# Altium project Core429IBaseBoardVerE.PrjPCB
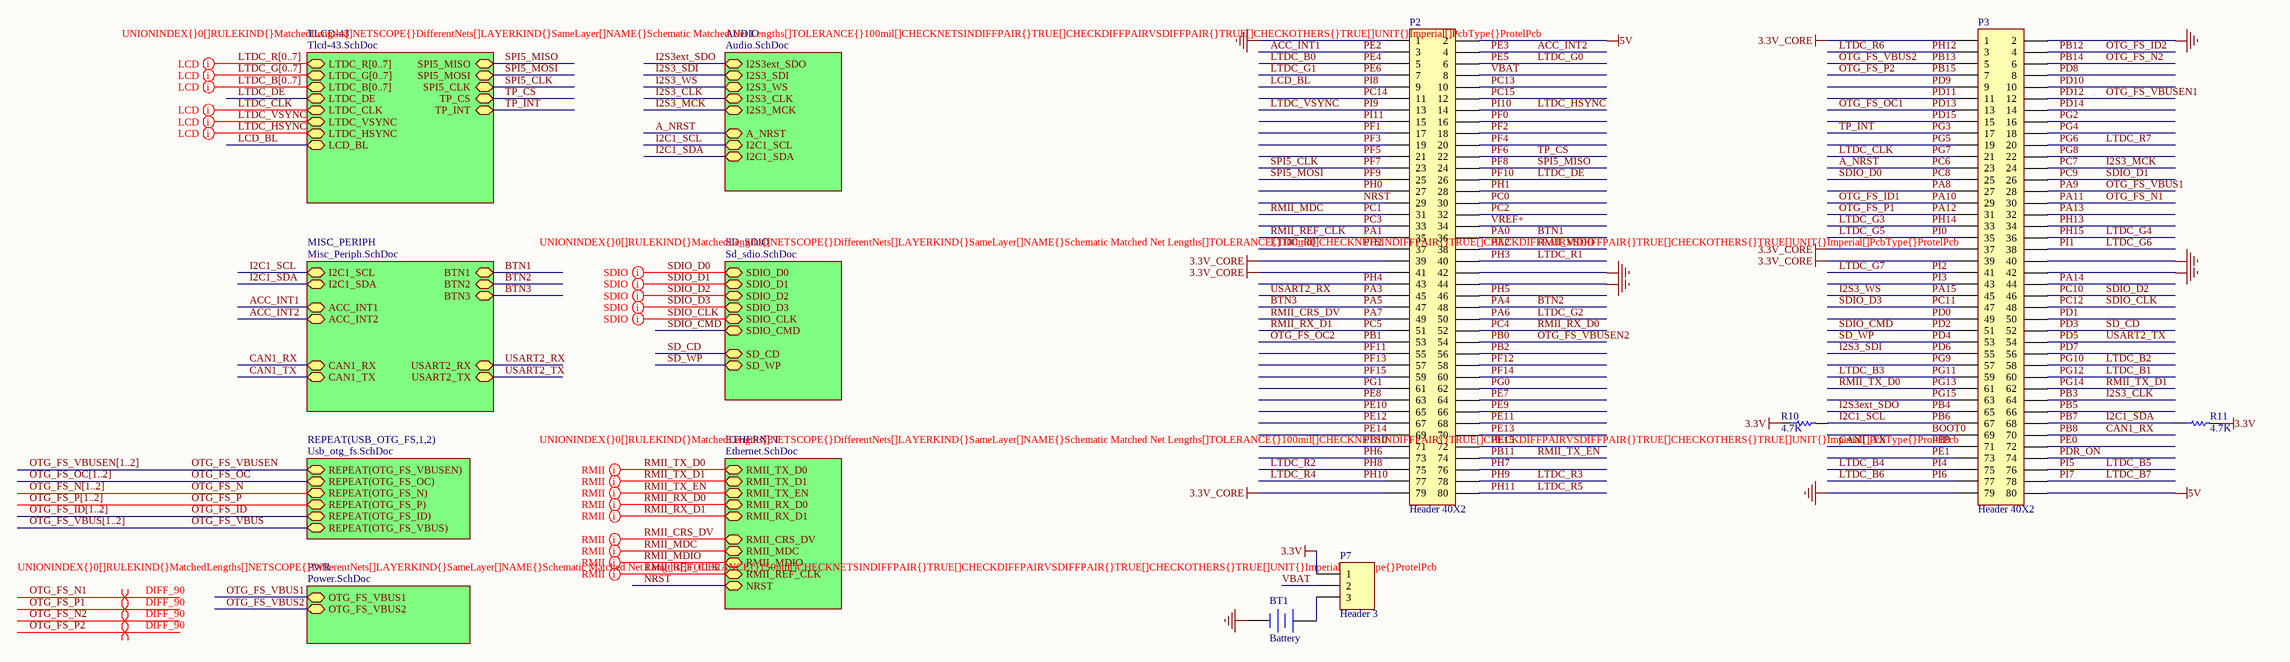
[diagram p0: Core429IBaseBoardVerE.SchDoc]
8 sheets, 137 parts. Net scope: hierarchical (ports join the sheet entries above them; power ports are global).
Board file: Core429IBaseBoardVerE.PcbDoc
Sheets:
  Core429IBaseBoardVerE.SchDoc
    PWR = Power.SchDoc
    AUDIO = Audio.SchDoc
    ETHERNET = Ethernet.SchDoc
    SD_SDIO = Sd_sdio.SchDoc
    TLCD-43 = Tlcd-43.SchDoc
    MISC_PERIPH = Misc_Periph.SchDoc
    USB_OTG_FS1 = Usb_otg_fs.SchDoc
    USB_OTG_FS2 = Usb_otg_fs.SchDoc

## Sheet Core429IBaseBoardVerE.SchDoc
size A2

### Parts
BT1  Battery  [PN3000]
P2  Header 40X2  [SHDR2X40]
P3  Header 40X2  [SHDR2X40]
P7  Header 3  [HDR1X3]
R10  value 4.7K  [RESC2012N]  (hidden comment: Res)
R11  value 4.7K  [RESC2012N]  (hidden comment: Res)

### Sub-sheets
AUDIO = Audio.SchDoc: I2S3_SDI, I2S3_WS, I2S3_CLK, I2S3_MCK, A_NRST, I2C1_SCL, I2C1_SDA, I2S3ext_SDO
ETHERNET = Ethernet.SchDoc: RMII_TX_D0, RMII_TX_D1, RMII_TX_EN, RMII_RX_D0, RMII_RX_D1, RMII_CRS_DV, RMII_MDC, RMII_MDIO, RMII_REF_CLK, NRST
MISC_PERIPH = Misc_Periph.SchDoc: I2C1_SCL, I2C1_SDA, ACC_INT1, ACC_INT2, BTN3, BTN2, BTN1, CAN1_RX, CAN1_TX, USART2_TX, USART2_RX
PWR = Power.SchDoc: OTG_FS_VBUS1, OTG_FS_VBUS2
REPEAT(USB_OTG_FS,1,2) = Usb_otg_fs.SchDoc: REPEAT(OTG_FS_VBUSEN), REPEAT(OTG_FS_OC), REPEAT(OTG_FS_N), REPEAT(OTG_FS_P), REPEAT(OTG_FS_ID), REPEAT(OTG_FS_VBUS)
SD_SDIO = Sd_sdio.SchDoc: SDIO_D0, SDIO_D1, SDIO_D2, SDIO_D3, SDIO_CLK, SDIO_CMD, SD_CD, SD_WP
TLCD-43 = Tlcd-43.SchDoc: LTDC_R[0..7], LTDC_G[0..7], LTDC_B[0..7], LTDC_DE, LTDC_CLK, LTDC_VSYNC, LTDC_HSYNC, LCD_BL, TP_INT, TP_CS, SPI5_CLK, SPI5_MOSI, SPI5_MISO

### Nets
3.3V: P7.1 R10.1 R11.2
3.3V_CORE: P2.39 P2.41 P2.79 P3.1 P3.37 P3.39
5V: P2.2 P3.80
DGND: BT1.2(-) P2.1 P2.42 P2.44 P3.2 P3.40 P3.42 P3.79
A_NRST: P3.23 ; sheet AUDIO/A_NRST  [also labelled PC6]
ACC_INT1: P2.3 ; sheet MISC_PERIPH/ACC_INT1  [also labelled PE2]
ACC_INT2: P2.4 ; sheet MISC_PERIPH/ACC_INT2  [also labelled PE3]
BOOT0: P3.69
BTN1: P2.36 ; sheet MISC_PERIPH/BTN1  [also labelled PA0]
BTN2: P2.48 ; sheet MISC_PERIPH/BTN2  [also labelled PA4]
BTN3: P2.47 ; sheet MISC_PERIPH/BTN3  [also labelled PA5]
CAN1_RX: P3.70 ; sheet MISC_PERIPH/CAN1_RX  [also labelled PB8]
CAN1_TX: P3.71 ; sheet MISC_PERIPH/CAN1_TX  [also labelled PB9]
I2C1_SCL: P3.67 R10.2 ; sheet AUDIO/I2C1_SCL, sheet MISC_PERIPH/I2C1_SCL  [also labelled PB6]
I2C1_SDA: P3.68 R11.1 ; sheet AUDIO/I2C1_SDA, sheet MISC_PERIPH/I2C1_SDA  [also labelled PB7]
I2S3_CLK: P3.64 ; sheet AUDIO/I2S3_CLK  [also labelled PB3]
I2S3_MCK: P3.24 ; sheet AUDIO/I2S3_MCK  [also labelled PC7]
I2S3_SDI: P3.55 ; sheet AUDIO/I2S3_SDI  [also labelled PD6]
I2S3_WS: P3.45 ; sheet AUDIO/I2S3_WS  [also labelled PA15]
I2S3ext_SDO: P3.65 ; sheet AUDIO/I2S3ext_SDO  [also labelled PB4]
LCD_BL: P2.9 ; sheet TLCD-43/LCD_BL  [also labelled PI8]
LTDC_B0: P2.5  [also labelled PE4]
LTDC_B1: P3.60  [also labelled PG12]
LTDC_B2: P3.58  [also labelled PG10]
LTDC_B3: P3.59  [also labelled PG11]
LTDC_B4: P3.75  [also labelled PI4]
LTDC_B5: P3.76  [also labelled PI5]
LTDC_B6: P3.77  [also labelled PI6]
LTDC_B7: P3.78  [also labelled PI7]
LTDC_CLK: P3.21 ; sheet TLCD-43/LTDC_CLK  [also labelled PG7]
LTDC_DE: P2.26 ; sheet TLCD-43/LTDC_DE  [also labelled PF10]
LTDC_G0: P2.6  [also labelled PE5]
LTDC_G1: P2.7  [also labelled PE6]
LTDC_G2: P2.50  [also labelled PA6]
LTDC_G3: P3.33  [also labelled PH14]
LTDC_G4: P3.36  [also labelled PH15]
LTDC_G5: P3.35  [also labelled PI0]
LTDC_G6: P3.38  [also labelled PI1]
LTDC_G7: P3.41  [also labelled PI2]
LTDC_HSYNC: P2.14 ; sheet TLCD-43/LTDC_HSYNC  [also labelled PI10]
LTDC_R0: P2.37  [also labelled PH2]
LTDC_R1: P2.40  [also labelled PH3]
LTDC_R2: P2.75  [also labelled PH8]
LTDC_R3: P2.78  [also labelled PH9]
LTDC_R4: P2.77  [also labelled PH10]
LTDC_R5: P2.80  [also labelled PH11]
LTDC_R6: P3.3  [also labelled PH12]
LTDC_R7: P3.20  [also labelled PG6]
LTDC_VSYNC: P2.13 ; sheet TLCD-43/LTDC_VSYNC  [also labelled PI9]
NRST: P2.29 ; sheet ETHERNET/NRST
OTG_FS_ID: sheet REPEAT(USB_OTG_FS,1,2)/REPEAT(OTG_FS_ID)
OTG_FS_ID1: P3.29  [also labelled PA10]
OTG_FS_ID2: P3.4  [also labelled PB12]
OTG_FS_N: sheet REPEAT(USB_OTG_FS,1,2)/REPEAT(OTG_FS_N)
OTG_FS_N1: P3.30  [also labelled PA11]
OTG_FS_N2: P3.6  [also labelled PB14]
OTG_FS_OC: sheet REPEAT(USB_OTG_FS,1,2)/REPEAT(OTG_FS_OC)
OTG_FS_OC1: P3.13  [also labelled PD13]
OTG_FS_OC2: P2.53  [also labelled PB1]
OTG_FS_P: sheet REPEAT(USB_OTG_FS,1,2)/REPEAT(OTG_FS_P)
OTG_FS_P1: P3.31  [also labelled PA12]
OTG_FS_P2: P3.7  [also labelled PB15]
OTG_FS_VBUS: sheet REPEAT(USB_OTG_FS,1,2)/REPEAT(OTG_FS_VBUS)
OTG_FS_VBUS1: P3.28 ; sheet PWR/OTG_FS_VBUS1  [also labelled PA9]
OTG_FS_VBUS2: P3.5 ; sheet PWR/OTG_FS_VBUS2  [also labelled PB13]
OTG_FS_VBUSEN: sheet REPEAT(USB_OTG_FS,1,2)/REPEAT(OTG_FS_VBUSEN)
OTG_FS_VBUSEN1: P3.12  [also labelled PD12]
OTG_FS_VBUSEN2: P2.54  [also labelled PB0]
PA1: P2.35 ; sheet ETHERNET/RMII_REF_CLK  [also labelled RMII_REF_CLK]
PA2: P2.38 ; sheet ETHERNET/RMII_MDIO  [also labelled RMII_MDIO]
PA3: P2.45 ; sheet MISC_PERIPH/USART2_RX  [also labelled USART2_RX]
PA7: P2.49 ; sheet ETHERNET/RMII_CRS_DV  [also labelled RMII_CRS_DV]
PA8: P3.27
PA13: P3.32
PA14: P3.44
PB2: P2.56
PB5: P3.66
PB10: P2.71
PB11: P2.74 ; sheet ETHERNET/RMII_TX_EN  [also labelled RMII_TX_EN]
PC0: P2.30
PC1: P2.31 ; sheet ETHERNET/RMII_MDC  [also labelled RMII_MDC]
PC2: P2.32
PC3: P2.33
PC4: P2.52 ; sheet ETHERNET/RMII_RX_D0  [also labelled RMII_RX_D0]
PC5: P2.51 ; sheet ETHERNET/RMII_RX_D1  [also labelled RMII_RX_D1]
PC8: P3.25 ; sheet SD_SDIO/SDIO_D0  [also labelled SDIO_D0]
PC9: P3.26 ; sheet SD_SDIO/SDIO_D1  [also labelled SDIO_D1]
PC10: P3.46 ; sheet SD_SDIO/SDIO_D2  [also labelled SDIO_D2]
PC11: P3.47 ; sheet SD_SDIO/SDIO_D3  [also labelled SDIO_D3]
PC12: P3.48 ; sheet SD_SDIO/SDIO_CLK  [also labelled SDIO_CLK]
PC13: P2.10
PC14: P2.11
PC15: P2.12
PD0: P3.49
PD1: P3.50
PD2: P3.51 ; sheet SD_SDIO/SDIO_CMD  [also labelled SDIO_CMD]
PD3: P3.52 ; sheet SD_SDIO/SD_CD  [also labelled SD_CD]
PD4: P3.53 ; sheet SD_SDIO/SD_WP  [also labelled SD_WP]
PD5: P3.54 ; sheet MISC_PERIPH/USART2_TX  [also labelled USART2_TX]
PD7: P3.56
PD8: P3.8
PD9: P3.9
PD10: P3.10
PD11: P3.11
PD14: P3.14
PD15: P3.15
PDR_ON: P3.74
PE0: P3.72
PE1: P3.73
PE7: P2.64
PE8: P2.63
PE9: P2.66
PE10: P2.65
PE11: P2.68
PE12: P2.67
PE13: P2.70
PE14: P2.69
PE15: P2.72
PF0: P2.16
PF1: P2.17
PF2: P2.18
PF3: P2.19
PF4: P2.20
PF5: P2.21
PF6: P2.22 ; sheet TLCD-43/TP_CS  [also labelled TP_CS]
PF7: P2.23 ; sheet TLCD-43/SPI5_CLK  [also labelled SPI5_CLK]
PF8: P2.24 ; sheet TLCD-43/SPI5_MISO  [also labelled SPI5_MISO]
PF9: P2.25 ; sheet TLCD-43/SPI5_MOSI  [also labelled SPI5_MOSI]
PF11: P2.55
PF12: P2.58
PF13: P2.57
PF14: P2.60
PF15: P2.59
PG0: P2.62
PG1: P2.61
PG2: P3.16
PG3: P3.17 ; sheet TLCD-43/TP_INT  [also labelled TP_INT]
PG4: P3.18
PG5: P3.19
PG8: P3.22
PG9: P3.57
PG13: P3.61 ; sheet ETHERNET/RMII_TX_D0  [also labelled RMII_TX_D0]
PG14: P3.62 ; sheet ETHERNET/RMII_TX_D1  [also labelled RMII_TX_D1]
PG15: P3.63
PH0: P2.27
PH1: P2.28
PH4: P2.43
PH5: P2.46
PH6: P2.73
PH7: P2.76
PH13: P3.34
PI3: P3.43
PI11: P2.15
VBAT: P2.8 P7.2
VREF+: P2.34
NetBT1_1: BT1.1(+) P7.3

### Buses and harness runs
bus LTDC_B[0..7] = sheet TLCD-43/LTDC_B[0..7]
bus LTDC_G[0..7] = sheet TLCD-43/LTDC_G[0..7]
bus LTDC_R[0..7] = sheet TLCD-43/LTDC_R[0..7]
bus OTG_FS_ID[1..2]
bus OTG_FS_N[1..2]
bus OTG_FS_OC[1..2]
bus OTG_FS_P[1..2]
bus OTG_FS_VBUS[1..2]
bus OTG_FS_VBUSEN[1..2]

### Layout directives
net class RMII; rule Matched Net Lengths [Tolerance = 100mil]: PA1, PA2, PA7, PB11, PC1, PC4, PC5, PG13, PG14
net class LCD; rule Matched Net Lengths [Tolerance = 100mil]: (no net found under the mark), LTDC_CLK, LTDC_HSYNC, LTDC_VSYNC
differential pair; net class DIFF_90; rule Matched Net Lengths [Tolerance = 150mil]: OTG_FS_N1, OTG_FS_N2, OTG_FS_P1, OTG_FS_P2
net class SDIO; rule Matched Net Lengths [Tolerance = 100mil]: PC8, PC9, PC10, PC11, PC12

### Library data of the parts
BT1 = Battery: Multicell Battery
P2 P3 = Header 40X2: Header, 40-Pin, Dual row
P7 = Header 3: Header, 3-Pin
R10 R11 = Res: Resistor

## Sheet Power.SchDoc
size A4
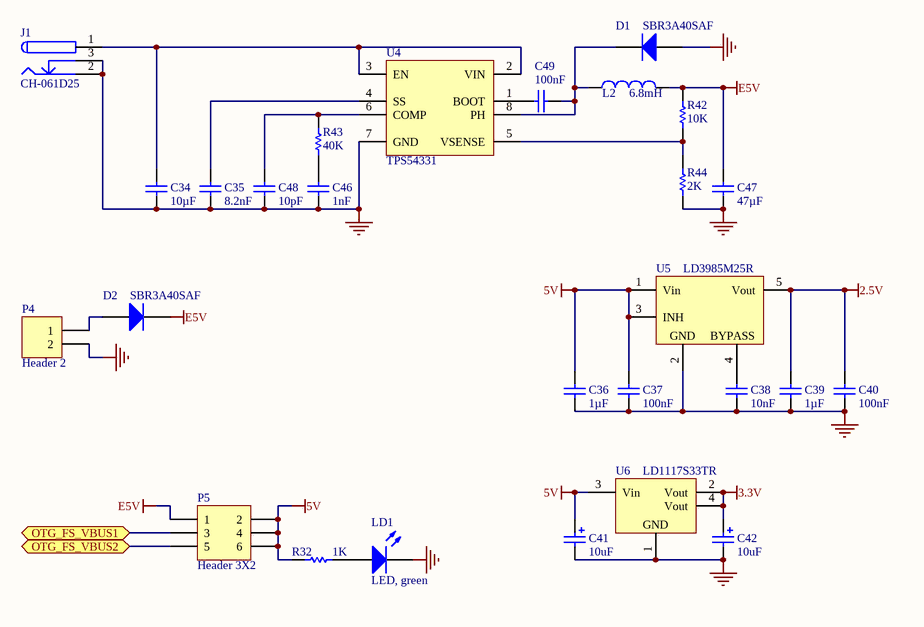
[diagram p1: Power.SchDoc]

### Parts
C34  value 10µF  [CAPC3216N]  (hidden comment: Cap)
C35  value 8.2nF  [CAPC2012N]  (hidden comment: Cap)
C36  value 1µF  [CAPC3216N]  (hidden comment: Cap)
C37  value 100nF  [CAPC2012N]  (hidden comment: Cap)
C38  value 10nF  [CAPC2012N]  (hidden comment: Cap)
C39  value 1µF  [CAPC3216N]  (hidden comment: Cap)
C40  value 100nF  [CAPC2012N]  (hidden comment: Cap)
C41  value 10uF  [TC3216-1206]  (hidden comment: Cap Pol)
C42  value 10uF  [TC3216-1206]  (hidden comment: Cap Pol)
C46  value 1nF  [CAPC2012N]  (hidden comment: Cap)
C47  value 47µF  [CAPC3216N]  (hidden comment: Cap)
C48  value 10pF  [CAPC2012N]  (hidden comment: Cap)
C49  value 100nF  [CAPC2012N]  (hidden comment: Cap)
D1  SBR3A40SAF  [CD-DO214AC]
D2  SBR3A40SAF  [CD-DO214AC]
J1  CH-061D25  [CH-061D25]
L2  value 6.8mH  [INDP6560X45M]  (hidden comment: Inductor)
LD1  LED, green  [CLED2012-0805]
P4  Header 2  [HDR1X2H]
P5  Header 3X2  [HDR2X3]
R32  value 1K  [RESC2012N]  (hidden comment: 1206)
R42  value 10K  [RESC2012N]  (hidden comment: Res)
R43  value 40K  [RESC2012N]  (hidden comment: Res)
R44  value 2K  [RESC2012N]  (hidden comment: Res)
U4  TPS54331  [SOIC127P600X173-8M]
U5  LD3985M25R  [SOT95P280X145-5M]
U6  LD1117S33TR  [SOT230P700X181-4M]

### Ports
OTG_FS_VBUS1 (bidir), OTG_FS_VBUS2 (bidir)

### Nets
2.5V: C39.2 C40.2 U5.5(Vout)
3.3V: C42.1 U6.2(Vout) U6.4(Vout)
5V: C36.2 C37.2 C41.1 P5.2 P5.4 P5.6 R32.2 U5.1(Vin) U5.3(INH) U6.3(Vin)
DGND: C34.1 C35.1 C36.1 C37.1 C38.1 C39.1 C40.1 C41.2 C42.2 C46.1 C47.1 C48.1 D1.1(A) J1.2 J1.3 LD1.2(K) P4.2 R44.1 U4.7(GND) U5.2(GND) U6.1(GND)
E5V: C47.2 D2.2(K) L2.2 P5.1 R42.2
OTG_FS_VBUS1: P5.3 ; port OTG_FS_VBUS1
OTG_FS_VBUS2: P5.5 ; port OTG_FS_VBUS2
NetC34_2: C34.2 J1.1 U4.2(VIN) U4.3(EN)
NetC35_2: C35.2 U4.4(SS)
NetC38_2: C38.2 U5.4(BYPASS)
NetC46_2: C46.2 R43.1
NetC48_2: C48.2 R43.2 U4.6(COMP)
NetC49_1: C49.1 D1.2(K) L2.1 U4.8(PH)
NetC49_2: C49.2 U4.1(BOOT)
NetD2_1: D2.1(A) P4.1
NetLD1_1: LD1.1(A) R32.1
NetR42_1: R42.1 R44.2 U4.5(VSENSE)

### Library data of the parts
C34-C40 C46-C49 = Cap: Capacitor
C41 C42 = Cap Pol: Polarized Capacitor
D1 D2 = Diode: Default Diode
J1 = PWR2.5: Low Voltage Power Supply Connector
LD1 = LED: Light emitting diode
P4 = Header 2: Header, 2-Pin
P5 = Header 3X2: Header, 3-Pin, Dual row
R32 R42-R44 = Res: Resistor
U4 = TPS54331: 3-A, 28-V Input, Step Down DC-DC Converter With Eco-mode
U5 = LD3985M: Ultra low drop-low noise BiCMOS voltage  regulators low ESR capacitors compatible
U6 = LD1117S: Adjustable and fixed low drop positive voltage regulator

## Sheet Audio.SchDoc
size A4
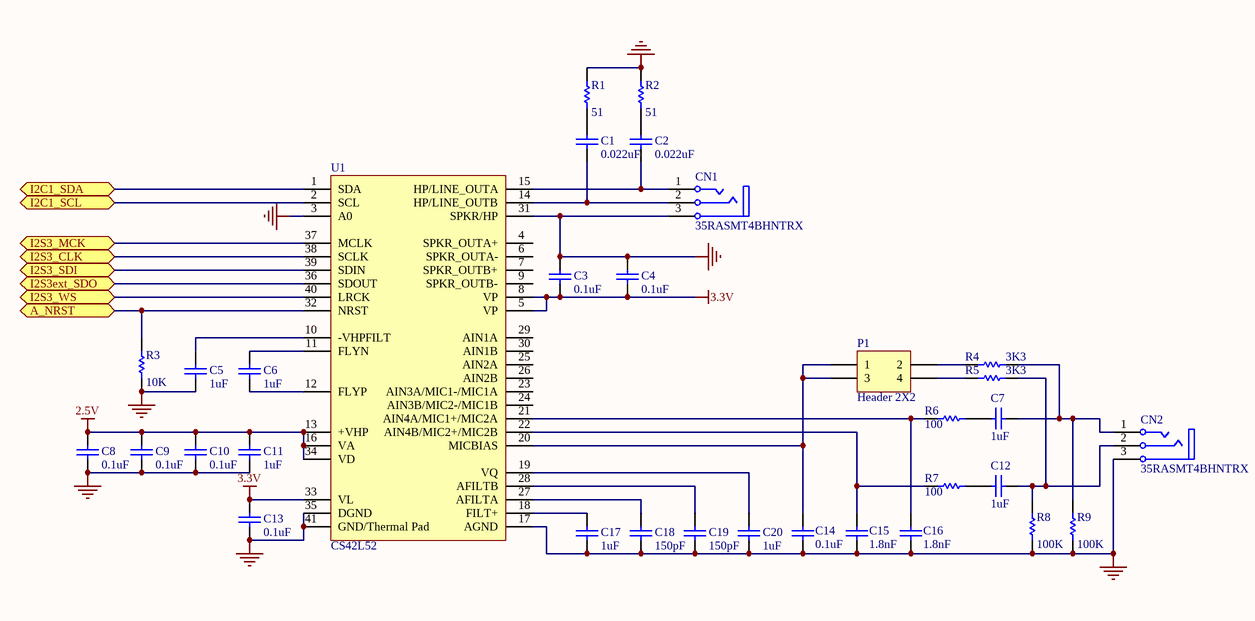
[diagram p2: Audio.SchDoc]

### Parts
C1  value 0.022uF  [CAPC2012N]  (hidden comment: Cap)
C2  value 0.022uF  [CAPC2012N]  (hidden comment: Cap)
C3  value 0.1uF  [CAPC2012N]  (hidden comment: Cap)
C4  value 0.1uF  [CAPC2012N]  (hidden comment: Cap)
C5  value 1uF  [CAPC3216N]  (hidden comment: Cap)
C6  value 1uF  [CAPC3216N]  (hidden comment: Cap)
C7  value 1uF  [CAPC3216N]  (hidden comment: Cap)
C8  value 0.1uF  [CAPC2012N]  (hidden comment: Cap)
C9  value 0.1uF  [CAPC2012N]  (hidden comment: Cap)
C10  value 0.1uF  [CAPC2012N]  (hidden comment: Cap)
C11  value 1uF  [CAPC3216N]  (hidden comment: Cap)
C12  value 1uF  [CAPC3216N]  (hidden comment: Cap)
C13  value 0.1uF  [CAPC2012N]  (hidden comment: Cap)
C14  value 0.1uF  [CAPC2012N]  (hidden comment: Cap)
C15  value 1.8nF  [CAPC2012N]  (hidden comment: Cap)
C16  value 1.8nF  [CAPC2012N]  (hidden comment: Cap)
C17  value 1uF  [CAPC3216N]  (hidden comment: Cap)
C18  value 150pF  [CAPC2012N]  (hidden comment: Cap)
C19  value 150pF  [CAPC2012N]  (hidden comment: Cap)
C20  value 1uF  [CAPC3216N]  (hidden comment: Cap)
CN1  35RASMT4BHNTRX  [35RASMT4BHNTRX]
CN2  35RASMT4BHNTRX  [35RASMT4BHNTRX]
P1  Header 2X2  [HDR2X2]
R1  value 51  [RESC2012N]  (hidden comment: 1206)
R2  value 51  [RESC2012N]  (hidden comment: 1206)
R3  value 10K  [RESC2012N]  (hidden comment: 1206)
R4  value 3K3  [RESC2012N]  (hidden comment: 1206)
R5  value 3K3  [RESC2012N]  (hidden comment: 1206)
R6  value 100  [RESC2012N]  (hidden comment: 1206)
R7  value 100  [RESC2012N]  (hidden comment: 1206)
R8  value 100K  [RESC2012N]  (hidden comment: 1206)
R9  value 100K  [RESC2012N]  (hidden comment: 1206)
U1  CS42L52  [QFN50P600X600X100-40M]

### Ports
A_NRST (bidir), I2C1_SCL (bidir), I2C1_SDA (bidir), I2S3_CLK (bidir), I2S3_MCK (bidir), I2S3_SDI (bidir), I2S3_WS (bidir), I2S3ext_SDO (bidir)

### Nets
2.5V: C8.2 C9.2 C10.2 C11.2 U1.13(+VHP) U1.16(VA) U1.34(VD)
3.3V: C3.1 C4.1 C13.2 U1.5(VP) U1.8(VP) U1.33(VL)
DGND: C3.2 C4.2 C5.1 C8.1 C9.1 C10.1 C11.1 C13.1 C14.2 C15.2 C16.2 C17.1 C18.1 C19.1 C20.1 CN1.3(S) CN2.3(S) R1.2 R2.2 R3.1 R8.1 R9.1 U1.3(A0) U1.17(AGND) U1.31(SPKR/HP) U1.35(DGND) U1.41(GND/Thermal_Pad)
A_NRST: R3.2 U1.32(NRST) ; port A_NRST
I2C1_SCL: U1.2(SCL) ; port I2C1_SCL
I2C1_SDA: U1.1(SDA) ; port I2C1_SDA
I2S3_CLK: U1.38(SCLK) ; port I2S3_CLK
I2S3_MCK: U1.37(MCLK) ; port I2S3_MCK
I2S3_SDI: U1.39(SDIN) ; port I2S3_SDI
I2S3_WS: U1.40(LRCK) ; port I2S3_WS
I2S3ext_SDO: U1.36(SDOUT) ; port I2S3ext_SDO
NetC1_1: C1.1 CN1.2(R) U1.14(HP/LINE_OUTB)
NetC1_2: C1.2 R1.1
NetC2_1: C2.1 CN1.1(T) U1.15(HP/LINE_OUTA)
NetC2_2: C2.2 R2.1
NetC5_2: C5.2 U1.10(-VHPFILT)
NetC6_1: C6.1 U1.12(FLYP)
NetC6_2: C6.2 U1.11(FLYN)
NetC7_1: C7.1 CN2.1(T) R4.1 R9.2
NetC7_2: C7.2 R6.1
NetC12_1: C12.1 CN2.2(R) R5.1 R8.2
NetC12_2: C12.2 R7.1
NetC14_1: C14.1 P1.1 P1.3 U1.20(MICBIAS)
NetC15_1: C15.1 R7.2 U1.22(AIN4B/MIC2+/MIC2B)
NetC16_1: C16.1 R6.2 U1.21(AIN4A/MIC1+/MIC2A)
NetC17_2: C17.2 U1.18(FILT+)
NetC18_2: C18.2 U1.27(AFILTA)
NetC19_2: C19.2 U1.28(AFILTB)
NetC20_2: C20.2 U1.19(VQ)
NetP1_2: P1.2 R4.2
NetP1_4: P1.4 R5.2

Not connected (* = marked no-connect by the designer): U1 4(SPKR_OUTA+) 6(SPKR_OUTA-) 7(SPKR_OUTB+) 9(SPKR_OUTB-) 23(AIN3A/MIC1-/MIC1A) 24(AIN3B/MIC2-/MIC1B) 25(AIN2A) 26(AIN2B) 29(AIN1A) 30(AIN1B)

### Library data of the parts
C1-C20 = Cap: Capacitor
CN1 CN2 = Phonejack3: 3.5mm Stereo Jack
P1 = Header 2X2: Header, 2-Pin, Dual row
R1-R9 = Res: Resistor
U1 = CS42L52: Low-power, Stereo CODEC w/ Headphone & Speaker Amps

## Sheet Ethernet.SchDoc
size A3
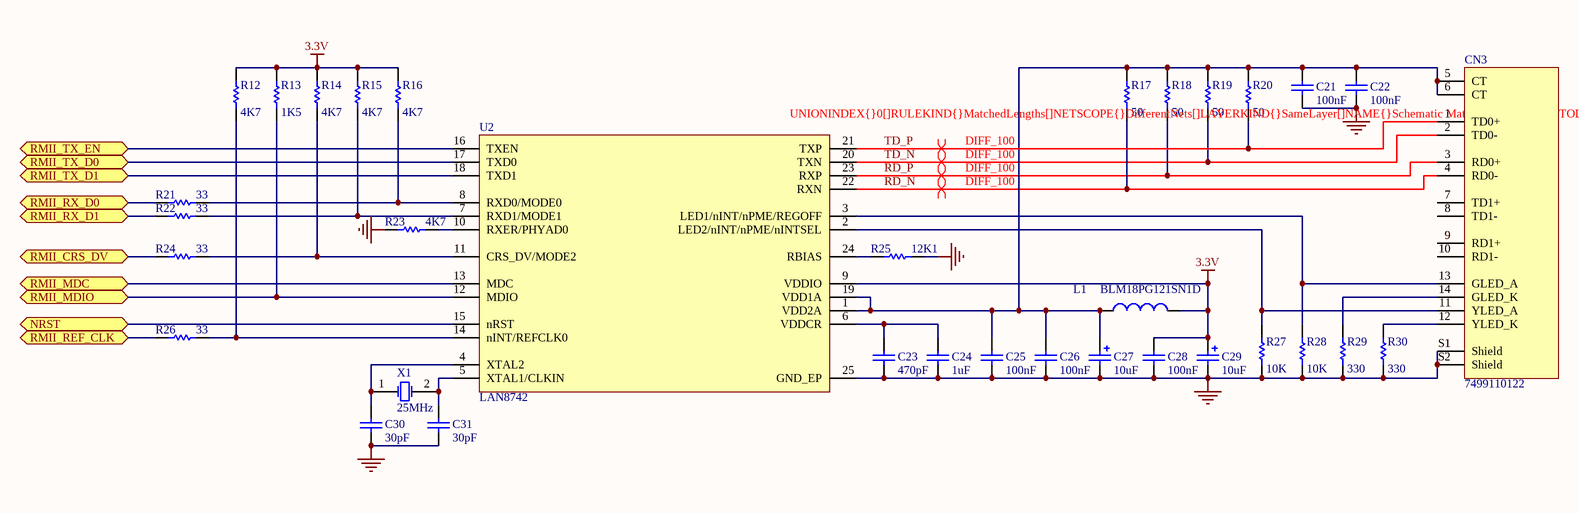
[diagram p3: Ethernet.SchDoc]

### Parts
C21  value 100nF  [CAPC2012N]  (hidden comment: Cap)
C22  value 100nF  [CAPC2012N]  (hidden comment: Cap)
C23  value 470pF  [CAPC2012N]  (hidden comment: Cap)
C24  value 1uF  [CAPC3216N]  (hidden comment: Cap)
C25  value 100nF  [CAPC2012N]  (hidden comment: Cap)
C26  value 100nF  [CAPC2012N]  (hidden comment: Cap)
C27  value 10uF  [TC3216-1206]  (hidden comment: Cap Pol)
C28  value 100nF  [CAPC2012N]  (hidden comment: Cap)
C29  value 10uF  [TC3216-1206]  (hidden comment: Cap Pol)
C30  value 30pF  [CAPC2012N]  (hidden comment: Cap)
C31  value 30pF  [CAPC2012N]  (hidden comment: Cap)
CN3  7499110122  [7499110122]
L1  value BLM18PG121SN1D  [INDC2012N]  (hidden comment: Inductor)
R12  value 4K7  [RESC2012N]  (hidden comment: 1206)
R13  value 1K5  [RESC2012N]  (hidden comment: 1206)
R14  value 4K7  [RESC2012N]  (hidden comment: 1206)
R15  value 4K7  [RESC2012N]  (hidden comment: 1206)
R16  value 4K7  [RESC2012N]  (hidden comment: 1206)
R17  value 50  [RESC2012N]  (hidden comment: 1206)
R18  value 50  [RESC2012N]  (hidden comment: 1206)
R19  value 50  [RESC2012N]  (hidden comment: 1206)
R20  value 50  [RESC2012N]  (hidden comment: 1206)
R21  value 33  [RESC2012N]  (hidden comment: 1206)
R22  value 33  [RESC2012N]  (hidden comment: 1206)
R23  value 4K7  [RESC2012N]  (hidden comment: 1206)
R24  value 33  [RESC2012N]  (hidden comment: 1206)
R25  value 12K1  [RESC2012N]  (hidden comment: 1206)
R26  value 33  [RESC2012N]  (hidden comment: 1206)
R27  value 10K  [RESC2012N]  (hidden comment: 1206)
R28  value 10K  [RESC2012N]  (hidden comment: 1206)
R29  value 330  [RESC2012N]  (hidden comment: 1206)
R30  value 330  [RESC2012N]  (hidden comment: 1206)
U2  LAN8742  [QFN50P400X400X100-24M]
X1  25MHz  [QC5CB]

### Ports
NRST (bidir), RMII_CRS_DV (bidir), RMII_MDC (bidir), RMII_MDIO (bidir), RMII_REF_CLK (bidir), RMII_RX_D0 (bidir), RMII_RX_D1 (bidir), RMII_TX_D0 (bidir), RMII_TX_D1 (bidir), RMII_TX_EN (bidir)

### Nets
3.3V: C28.2 C29.1 L1.2 R12.2 R13.2 R14.2 R15.2 R16.2 U2.9(VDDIO)
DGND: C21.1 C22.1 C23.1 C24.1 C25.1 C26.1 C27.2 C28.1 C29.2 C30.1 C31.1 CN3.S1(Shield) CN3.S2(Shield) R23.2 R25.1 R27.1 R28.1 R29.1 R30.1 U2.25(GND_EP)
NRST: U2.15(nRST) ; port NRST
PA1: R26.2 ; port RMII_REF_CLK
PA2: R13.1 U2.12(MDIO) ; port RMII_MDIO
PA7: R24.2 ; port RMII_CRS_DV
PB11: U2.16(TXEN) ; port RMII_TX_EN
PC1: U2.13(MDC) ; port RMII_MDC
PC4: R21.2 ; port RMII_RX_D0
PC5: R22.2 ; port RMII_RX_D1
PG13: U2.17(TXD0) ; port RMII_TX_D0
PG14: U2.18(TXD1) ; port RMII_TX_D1
RD_N: CN3.4(RD0-) R17.1 U2.22(RXN)
RD_P: CN3.3(RD0+) R18.1 U2.23(RXP)
TD_N: CN3.2(TD0-) R19.1 U2.20(TXN)
TD_P: CN3.1(TD0+) R20.1 U2.21(TXP)
NetC21_2: C21.2 C22.2 C25.2 C26.2 C27.1 CN3.5(CT) CN3.6(CT) L1.1 R17.2 R18.2 R19.2 R20.2 U2.1(VDD2A) U2.19(VDD1A)
NetC23_2: C23.2 C24.2 U2.6(VDDCR)
NetC30_2: C30.2 U2.4(XTAL2) X1.1(OSC1)
NetC31_2: C31.2 U2.5(XTAL1/CLKIN) X1.2(OSC2)
NetCN3_11: CN3.11(YLED_A) R27.2 U2.2(LED2/nINT/nPME/nINTSEL)
NetCN3_12: CN3.12(YLED_K) R30.2
NetCN3_13: CN3.13(GLED_A) R28.2 U2.3(LED1/nINT/nPME/REGOFF)
NetCN3_14: CN3.14(GLED_K) R29.2
NetR12_1: R12.1 R26.1 U2.14(nINT/REFCLK0)
NetR14_1: R14.1 R24.1 U2.11(CRS_DV/MODE2)
NetR15_1: R15.1 R22.1 U2.7(RXD1/MODE1)
NetR16_1: R16.1 R21.1 U2.8(RXD0/MODE0)
NetR23_1: R23.1 U2.10(RXER/PHYAD0)
NetR25_2: R25.2 U2.24(RBIAS)

Not connected (* = marked no-connect by the designer): CN3 7(TD1+) 8(TD1-) 9(RD1+) 10(RD1-)

### Layout directives
differential pair; net class DIFF_100; rule Matched Net Lengths [Tolerance = 100mil]: RD_N, RD_P, TD_N, TD_P

### Library data of the parts
C21-C26 C28 C30 C31 = Cap: Capacitor
C27 C29 = Cap Pol: Polarized Capacitor
CN3 = 7499110122: LAN-Transformer WE-RJ45LAN 10/100/1000 BaseT
R12-R30 = Res: Resistor
U2 = LAN8742: Small Footprint RMII 10/100 Ethernet Transceiver with HP Auto-MDIX and flexPWR Technology
X1 = XTAL: Crystal Oscillator

## Sheet Sd_sdio.SchDoc
size A4
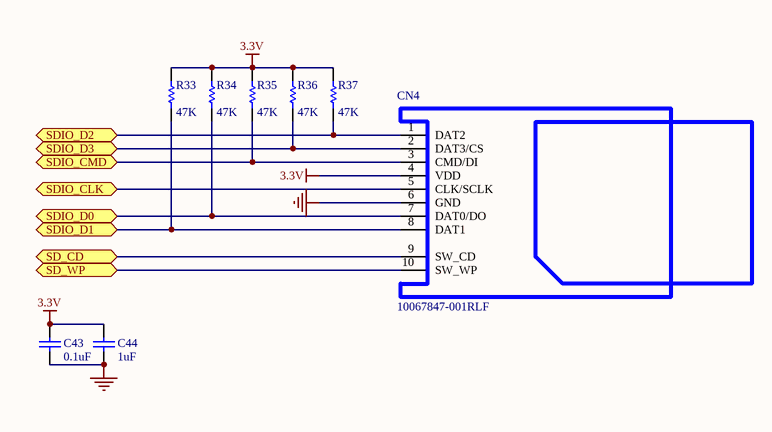
[diagram p4: Sd_sdio.SchDoc]

### Parts
C43  value 0.1uF  [CAPC2012N]  (hidden comment: Cap)
C44  value 1uF  [CAPC3216N]  (hidden comment: Cap)
CN4  10067847-001RLF  [10067847]
R33  value 47K  [RESC2012N]  (hidden comment: 1206)
R34  value 47K  [RESC2012N]  (hidden comment: 1206)
R35  value 47K  [RESC2012N]  (hidden comment: 1206)
R36  value 47K  [RESC2012N]  (hidden comment: 1206)
R37  value 47K  [RESC2012N]  (hidden comment: 1206)

### Ports
SD_CD (bidir), SD_WP (bidir), SDIO_CLK (bidir), SDIO_CMD (bidir), SDIO_D0 (bidir), SDIO_D1 (bidir), SDIO_D2 (bidir), SDIO_D3 (bidir)

### Nets
3.3V: C43.2 C44.2 CN4.4(VDD) R33.2 R34.2 R35.2 R36.2 R37.2
DGND: C43.1 C44.1 CN4.6(GND)
PC8: CN4.7(DAT0/DO) R34.1 ; port SDIO_D0
PC9: CN4.8(DAT1) R33.1 ; port SDIO_D1
PC10: CN4.1(DAT2) R37.1 ; port SDIO_D2
PC11: CN4.2(DAT3/CS) R36.1 ; port SDIO_D3
PC12: CN4.5(CLK/SCLK) ; port SDIO_CLK
PD2: CN4.3(CMD/DI) R35.1 ; port SDIO_CMD
PD3: CN4.9(SW_CD) ; port SD_CD
PD4: CN4.10(SW_WP) ; port SD_WP

### Library data of the parts
C43 C44 = Cap: Capacitor
CN4 = SD: SD Card Reader
R33-R37 = Res: Resistor

## Sheet Tlcd-43.SchDoc
size A4
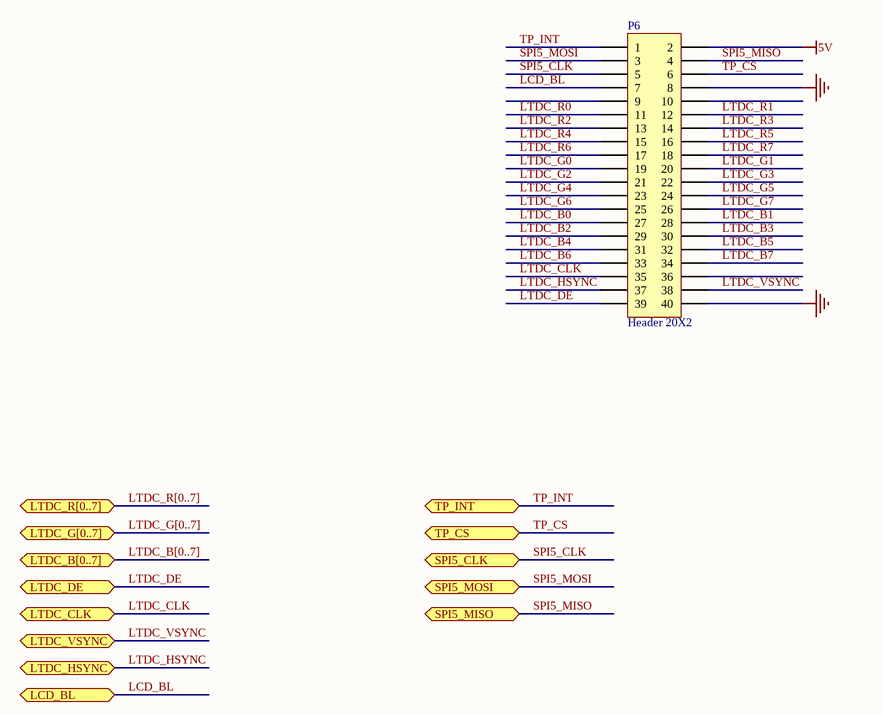
[diagram p5: Tlcd-43.SchDoc]

### Parts
P6  Header 20X2  [HDR2X20]

### Ports
LCD_BL (bidir), LTDC_B[0..7] (bidir), LTDC_CLK (bidir), LTDC_DE (bidir), LTDC_G[0..7] (bidir), LTDC_HSYNC (bidir), LTDC_R[0..7] (bidir), LTDC_VSYNC (bidir), SPI5_CLK (bidir), SPI5_MISO (bidir), SPI5_MOSI (bidir), TP_CS (bidir), TP_INT (bidir)

### Nets
5V: P6.2
DGND: P6.8 P6.40
LCD_BL: P6.7 ; port LCD_BL
LTDC_B0: P6.27
LTDC_B1: P6.28
LTDC_B2: P6.29
LTDC_B3: P6.30
LTDC_B4: P6.31
LTDC_B5: P6.32
LTDC_B6: P6.33
LTDC_B7: P6.34
LTDC_CLK: P6.35 ; port LTDC_CLK
LTDC_DE: P6.39 ; port LTDC_DE
LTDC_G0: P6.19
LTDC_G1: P6.20
LTDC_G2: P6.21
LTDC_G3: P6.22
LTDC_G4: P6.23
LTDC_G5: P6.24
LTDC_G6: P6.25
LTDC_G7: P6.26
LTDC_HSYNC: P6.37 ; port LTDC_HSYNC
LTDC_R0: P6.11
LTDC_R1: P6.12
LTDC_R2: P6.13
LTDC_R3: P6.14
LTDC_R4: P6.15
LTDC_R5: P6.16
LTDC_R6: P6.17
LTDC_R7: P6.18
LTDC_VSYNC: P6.38 ; port LTDC_VSYNC
SPI5_CLK: P6.5 ; port SPI5_CLK  [project net PF7]
SPI5_MISO: P6.4 ; port SPI5_MISO  [project net PF8]
SPI5_MOSI: P6.3 ; port SPI5_MOSI  [project net PF9]
TP_CS: P6.6 ; port TP_CS  [project net PF6]
TP_INT: P6.1 ; port TP_INT  [project net PG3]

Not connected (* = marked no-connect by the designer): P6 9 10 36

### Buses and harness runs
bus LTDC_B[0..7] = port LTDC_B[0..7]
bus LTDC_G[0..7] = port LTDC_G[0..7]
bus LTDC_R[0..7] = port LTDC_R[0..7]

### Library data of the parts
P6 = Header 20X2: Header, 20-Pin, Dual row

## Sheet Misc_Periph.SchDoc
size A4
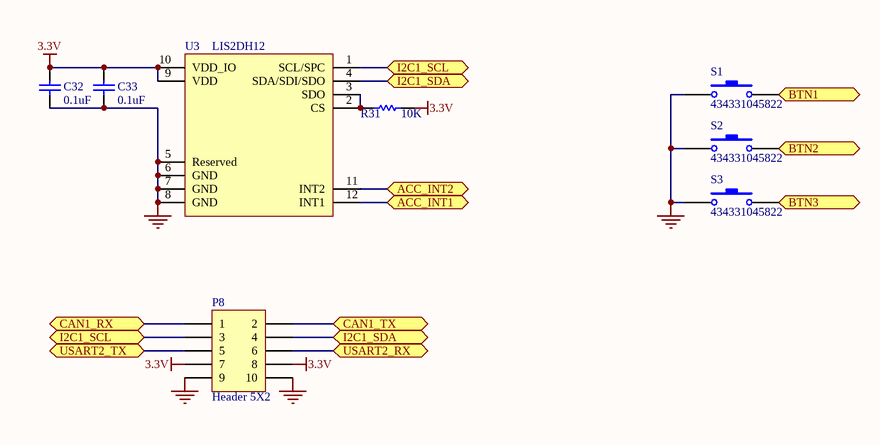
[diagram p6: Misc_Periph.SchDoc]

### Parts
C32  value 0.1uF  [CAPC2012N]  (hidden comment: Cap)
C33  value 0.1uF  [CAPC2012N]  (hidden comment: Cap)
P8  Header 5X2  [HDR2X5]
R31  value 10K  [RESC2012N]  (hidden comment: 1206)
S1  434331045822  [434331045822]
S2  434331045822  [434331045822]
S3  434331045822  [434331045822]
U3  LIS2DH12  [LGA12C50P4X4_200X200X100]

### Ports
ACC_INT1 (bidir), ACC_INT2 (bidir), BTN1 (bidir), BTN2 (bidir), BTN3 (bidir), CAN1_RX (bidir), CAN1_TX (bidir), I2C1_SCL (bidir), I2C1_SDA (bidir), USART2_RX (bidir), USART2_TX (bidir)

### Nets
3.3V: C32.2 C33.2 P8.7 P8.8 R31.1 U3.9(VDD) U3.10(VDD_IO)
DGND: C32.1 C33.1 P8.9 P8.10 S1.1 S2.1 S3.1 U3.5(Reserved) U3.6(GND) U3.7(GND) U3.8(GND)
ACC_INT1: U3.12(INT1) ; port ACC_INT1
ACC_INT2: U3.11(INT2) ; port ACC_INT2
BTN1: S1.2 ; port BTN1
BTN2: S2.2 ; port BTN2
BTN3: S3.2 ; port BTN3
CAN1_RX: P8.1 ; port CAN1_RX
CAN1_TX: P8.2 ; port CAN1_TX
I2C1_SCL: P8.3 U3.1(SCL/SPC) ; port I2C1_SCL
I2C1_SDA: P8.4 U3.4(SDA/SDI/SDO) ; port I2C1_SDA
PA3: P8.6 ; port USART2_RX
PD5: P8.5 ; port USART2_TX
NetR31_2: R31.2 U3.2(CS) U3.3(SDO)

### Library data of the parts
C32 C33 = Cap: Capacitor
P8 = Header 5X2: Header, 5-Pin, Dual row
R31 = Res: Resistor
S1-S3 = SW-PB: Momentary Push Button
U3 = LIS2DH12: MEMS digital output motion sensor ultra-low-power high-performance 3-axis "femto" accelerometer

## Sheet Usb_otg_fs.SchDoc
size A4
Used 2 times, as channels USB_OTG_FS1, USB_OTG_FS2. Parts and nets are listed once, with the designators drawn on the sheet.
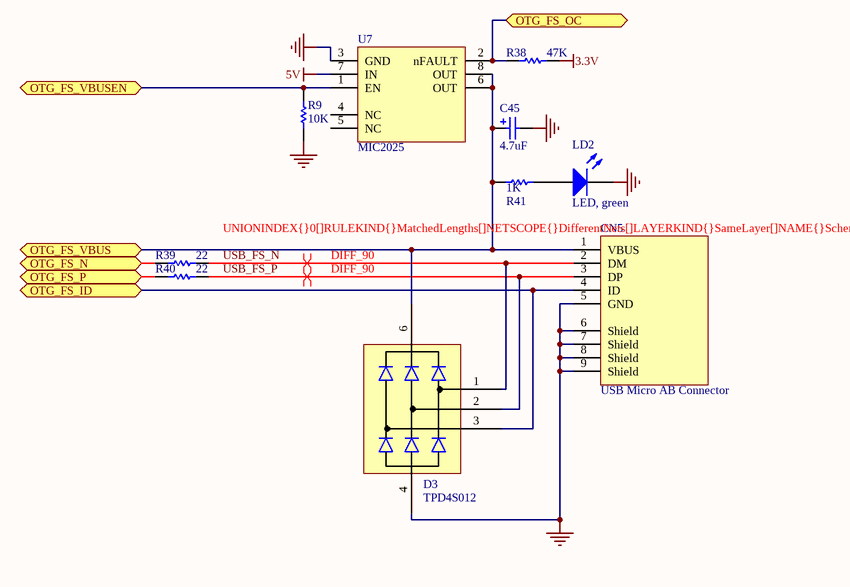
[diagram p7: Usb_otg_fs.SchDoc]

### Parts
C45  value 4.7uF  [TC3216-1206]  (hidden comment: Cap Pol)
CN5  USB Micro AB Connector  [ZX62RD-AB-5P8]
D3  TPD4S012  [SON50P100X60-6M]
LD2  LED, green  [CLED2012-0805]
R9  value 10K  [RESC2012N]  (hidden comment: Res)
R38  value 47K  [RESC2012N]  (hidden comment: 1206)
R39  value 22  [RESC2012N]  (hidden comment: 1206)
R40  value 22  [RESC2012N]  (hidden comment: 1206)
R41  value 1K  [RESC2012N]  (hidden comment: 1206)
U7  MIC2025  [SOIC127P600X173-8M]

### Ports
OTG_FS_ID (bidir), OTG_FS_N (bidir), OTG_FS_OC (bidir), OTG_FS_P (bidir), OTG_FS_VBUS (bidir), OTG_FS_VBUSEN (bidir)

### Nets
3.3V: R38.1
5V: U7.7(IN)
DGND: C45.2 CN5.5(GND) CN5.6(Shield) CN5.7(Shield) CN5.8(Shield) CN5.9(Shield) D3.4 LD2.2(K) R9.2 U7.3(GND)
OTG_FS_ID: CN5.4(ID) D3.3 ; port OTG_FS_ID
OTG_FS_N: R39.2 ; port OTG_FS_N
OTG_FS_OC: R38.2 U7.2(nFAULT) ; port OTG_FS_OC
OTG_FS_P: R40.2 ; port OTG_FS_P
OTG_FS_VBUS: C45.1 CN5.1(VBUS) D3.6 R41.2 U7.6(OUT) U7.8(OUT) ; port OTG_FS_VBUS
OTG_FS_VBUSEN: R9.1 U7.1(EN) ; port OTG_FS_VBUSEN
USB_FS_N: CN5.2(DM) D3.1 R39.1
USB_FS_P: CN5.3(DP) D3.2 R40.1
NetLD2_1: LD2.1(A) R41.1

Not connected (* = marked no-connect by the designer): U7 4(NC) 5(NC)

### Channels
USB_OTG_FS1: designators end in A; ports OTG_FS_ID=OTG_FS_ID1 OTG_FS_N=OTG_FS_N1 OTG_FS_OC=OTG_FS_OC1 OTG_FS_P=OTG_FS_P1 OTG_FS_VBUS=OTG_FS_VBUS1 OTG_FS_VBUSEN=OTG_FS_VBUSEN1
USB_OTG_FS2: designators end in B; ports OTG_FS_ID=OTG_FS_ID2 OTG_FS_N=OTG_FS_N2 OTG_FS_OC=OTG_FS_OC2 OTG_FS_P=OTG_FS_P2 OTG_FS_VBUS=OTG_FS_VBUS2 OTG_FS_VBUSEN=OTG_FS_VBUSEN2

### Layout directives
differential pair; net class DIFF_90; rule Matched Net Lengths [Tolerance = 150mil]: USB_FS_N_USB_OTG_FS1, USB_FS_P_USB_OTG_FS1

### Library data of the parts
C45 = Cap Pol: Polarized Capacitor
CN5 = USB Micro AB Connector: Micro-USB connectors meeting USB 2.0 Standard
D3 = TPD4S012: 4-Channel ESD Solution for USB-HS/USB OTG/USB Charger Interface
LD2 = LED: Light emitting diode
R9 R38-R41 = Res: Resistor
U7 = MIC2025: Single-Channel Power Distribution Switch MM8

## Nets that join several sheets
2.5V: Power (C39.2 C40.2 U5.5), Audio (7 pins)
3.3V: Core429IBaseBoardVerE (P7.1 R10.1 R11.2), Power (C42.1 U6.2 U6.4), Audio (6 pins), Ethernet (9 pins), Sd_sdio (8 pins), Misc_Periph (7 pins), USB_OTG_FS1 (R38A.1), USB_OTG_FS2 (R38B.1)
5V: Core429IBaseBoardVerE (P2.2 P3.80), Power (10 pins), Tlcd-43 (P6.2), USB_OTG_FS1 (U7A.7), USB_OTG_FS2 (U7B.7)
DGND: Core429IBaseBoardVerE (8 pins), Power (21 pins), Audio (27 pins), Ethernet (20 pins), Sd_sdio (C43.1 C44.1 CN4.6), Tlcd-43 (P6.8 P6.40), Misc_Periph (11 pins), USB_OTG_FS1 (10 pins), USB_OTG_FS2 (10 pins)
A_NRST: Core429IBaseBoardVerE (P3.23), Audio (R3.2 U1.32)
ACC_INT1: Core429IBaseBoardVerE (P2.3), Misc_Periph (U3.12)
ACC_INT2: Core429IBaseBoardVerE (P2.4), Misc_Periph (U3.11)
BTN1: Core429IBaseBoardVerE (P2.36), Misc_Periph (S1.2)
BTN2: Core429IBaseBoardVerE (P2.48), Misc_Periph (S2.2)
BTN3: Core429IBaseBoardVerE (P2.47), Misc_Periph (S3.2)
CAN1_RX: Core429IBaseBoardVerE (P3.70), Misc_Periph (P8.1)
CAN1_TX: Core429IBaseBoardVerE (P3.71), Misc_Periph (P8.2)
I2C1_SCL: Core429IBaseBoardVerE (P3.67 R10.2), Audio (U1.2), Misc_Periph (P8.3 U3.1)
I2C1_SDA: Core429IBaseBoardVerE (P3.68 R11.1), Audio (U1.1), Misc_Periph (P8.4 U3.4)
I2S3_CLK: Core429IBaseBoardVerE (P3.64), Audio (U1.38)
I2S3_MCK: Core429IBaseBoardVerE (P3.24), Audio (U1.37)
I2S3_SDI: Core429IBaseBoardVerE (P3.55), Audio (U1.39)
I2S3_WS: Core429IBaseBoardVerE (P3.45), Audio (U1.40)
I2S3ext_SDO: Core429IBaseBoardVerE (P3.65), Audio (U1.36)
LCD_BL: Core429IBaseBoardVerE (P2.9), Tlcd-43 (P6.7)
LTDC_B0: Core429IBaseBoardVerE (P2.5), Tlcd-43 (P6.27)
LTDC_B1: Core429IBaseBoardVerE (P3.60), Tlcd-43 (P6.28)
LTDC_B2: Core429IBaseBoardVerE (P3.58), Tlcd-43 (P6.29)
LTDC_B3: Core429IBaseBoardVerE (P3.59), Tlcd-43 (P6.30)
LTDC_B4: Core429IBaseBoardVerE (P3.75), Tlcd-43 (P6.31)
LTDC_B5: Core429IBaseBoardVerE (P3.76), Tlcd-43 (P6.32)
LTDC_B6: Core429IBaseBoardVerE (P3.77), Tlcd-43 (P6.33)
LTDC_B7: Core429IBaseBoardVerE (P3.78), Tlcd-43 (P6.34)
LTDC_CLK: Core429IBaseBoardVerE (P3.21), Tlcd-43 (P6.35)
LTDC_DE: Core429IBaseBoardVerE (P2.26), Tlcd-43 (P6.39)
LTDC_G0: Core429IBaseBoardVerE (P2.6), Tlcd-43 (P6.19)
LTDC_G1: Core429IBaseBoardVerE (P2.7), Tlcd-43 (P6.20)
LTDC_G2: Core429IBaseBoardVerE (P2.50), Tlcd-43 (P6.21)
LTDC_G3: Core429IBaseBoardVerE (P3.33), Tlcd-43 (P6.22)
LTDC_G4: Core429IBaseBoardVerE (P3.36), Tlcd-43 (P6.23)
LTDC_G5: Core429IBaseBoardVerE (P3.35), Tlcd-43 (P6.24)
LTDC_G6: Core429IBaseBoardVerE (P3.38), Tlcd-43 (P6.25)
LTDC_G7: Core429IBaseBoardVerE (P3.41), Tlcd-43 (P6.26)
LTDC_HSYNC: Core429IBaseBoardVerE (P2.14), Tlcd-43 (P6.37)
LTDC_R0: Core429IBaseBoardVerE (P2.37), Tlcd-43 (P6.11)
LTDC_R1: Core429IBaseBoardVerE (P2.40), Tlcd-43 (P6.12)
LTDC_R2: Core429IBaseBoardVerE (P2.75), Tlcd-43 (P6.13)
LTDC_R3: Core429IBaseBoardVerE (P2.78), Tlcd-43 (P6.14)
LTDC_R4: Core429IBaseBoardVerE (P2.77), Tlcd-43 (P6.15)
LTDC_R5: Core429IBaseBoardVerE (P2.80), Tlcd-43 (P6.16)
LTDC_R6: Core429IBaseBoardVerE (P3.3), Tlcd-43 (P6.17)
LTDC_R7: Core429IBaseBoardVerE (P3.20), Tlcd-43 (P6.18)
LTDC_VSYNC: Core429IBaseBoardVerE (P2.13), Tlcd-43 (P6.38)
NRST: Core429IBaseBoardVerE (P2.29), Ethernet (U2.15)
OTG_FS_ID1: Core429IBaseBoardVerE (P3.29), USB_OTG_FS1 (CN5A.4 D3A.3)
OTG_FS_ID2: Core429IBaseBoardVerE (P3.4), USB_OTG_FS2 (CN5B.4 D3B.3)
OTG_FS_N1: Core429IBaseBoardVerE (P3.30), USB_OTG_FS1 (R39A.2)
OTG_FS_N2: Core429IBaseBoardVerE (P3.6), USB_OTG_FS2 (R39B.2)
OTG_FS_OC1: Core429IBaseBoardVerE (P3.13), USB_OTG_FS1 (R38A.2 U7A.2)
OTG_FS_OC2: Core429IBaseBoardVerE (P2.53), USB_OTG_FS2 (R38B.2 U7B.2)
OTG_FS_P1: Core429IBaseBoardVerE (P3.31), USB_OTG_FS1 (R40A.2)
OTG_FS_P2: Core429IBaseBoardVerE (P3.7), USB_OTG_FS2 (R40B.2)
OTG_FS_VBUS1: Core429IBaseBoardVerE (P3.28), Power (P5.3), USB_OTG_FS1 (6 pins)
OTG_FS_VBUS2: Core429IBaseBoardVerE (P3.5), Power (P5.5), USB_OTG_FS2 (6 pins)
OTG_FS_VBUSEN1: Core429IBaseBoardVerE (P3.12), USB_OTG_FS1 (R9A.1 U7A.1)
OTG_FS_VBUSEN2: Core429IBaseBoardVerE (P2.54), USB_OTG_FS2 (R9B.1 U7B.1)
PA1: Core429IBaseBoardVerE (P2.35), Ethernet (R26.2)
PA2: Core429IBaseBoardVerE (P2.38), Ethernet (R13.1 U2.12)
PA3: Core429IBaseBoardVerE (P2.45), Misc_Periph (P8.6)
PA7: Core429IBaseBoardVerE (P2.49), Ethernet (R24.2)
PB11: Core429IBaseBoardVerE (P2.74), Ethernet (U2.16)
PC1: Core429IBaseBoardVerE (P2.31), Ethernet (U2.13)
PC4: Core429IBaseBoardVerE (P2.52), Ethernet (R21.2)
PC5: Core429IBaseBoardVerE (P2.51), Ethernet (R22.2)
PC8: Core429IBaseBoardVerE (P3.25), Sd_sdio (CN4.7 R34.1)
PC9: Core429IBaseBoardVerE (P3.26), Sd_sdio (CN4.8 R33.1)
PC10: Core429IBaseBoardVerE (P3.46), Sd_sdio (CN4.1 R37.1)
PC11: Core429IBaseBoardVerE (P3.47), Sd_sdio (CN4.2 R36.1)
PC12: Core429IBaseBoardVerE (P3.48), Sd_sdio (CN4.5)
PD2: Core429IBaseBoardVerE (P3.51), Sd_sdio (CN4.3 R35.1)
PD3: Core429IBaseBoardVerE (P3.52), Sd_sdio (CN4.9)
PD4: Core429IBaseBoardVerE (P3.53), Sd_sdio (CN4.10)
PD5: Core429IBaseBoardVerE (P3.54), Misc_Periph (P8.5)
PF6: Core429IBaseBoardVerE (P2.22), Tlcd-43 (P6.6)
PF7: Core429IBaseBoardVerE (P2.23), Tlcd-43 (P6.5)
PF8: Core429IBaseBoardVerE (P2.24), Tlcd-43 (P6.4)
PF9: Core429IBaseBoardVerE (P2.25), Tlcd-43 (P6.3)
PG3: Core429IBaseBoardVerE (P3.17), Tlcd-43 (P6.1)
PG13: Core429IBaseBoardVerE (P3.61), Ethernet (U2.17)
PG14: Core429IBaseBoardVerE (P3.62), Ethernet (U2.18)